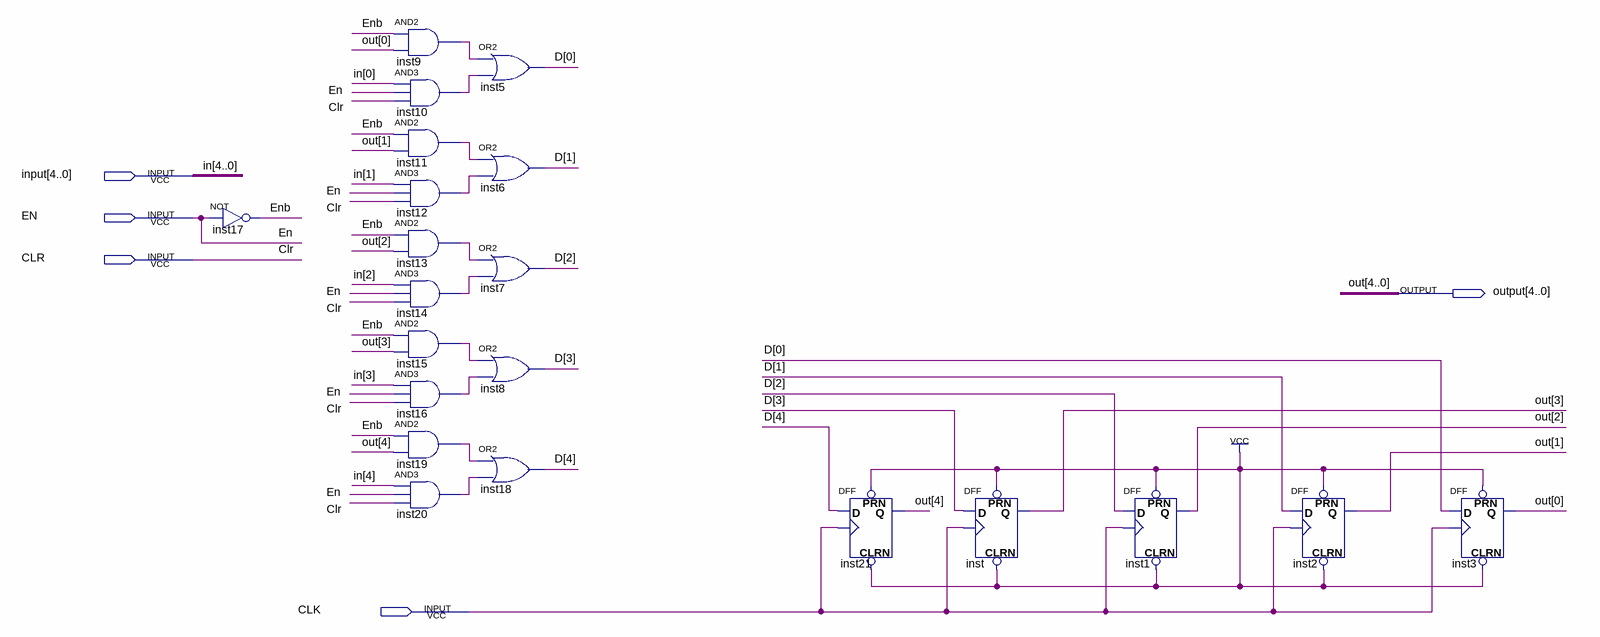
[diagram p0: schematic sheet]
// Quartus schematic Registrador5bits.bdf as structural Verilog: 21 symbols, 5 pins
module Registrador5bits (
  input  [4:0] \input ,
  input  EN,
  input  CLR,
  input  CLK,
  output [4:0] \output 
);

  wire Enb, inst9_out, inst10_out, inst11_out, inst12_out, inst13_out, inst14_out, inst15_out, inst16_out,
       inst19_out, inst20_out;
  wire [4:0] D;

  not inst17 (Enb, EN);
  and inst9 (inst9_out, Enb, \output [0]);
  and inst10 (inst10_out, \input [0], EN, CLR);
  and inst11 (inst11_out, Enb, \output [1]);
  and inst12 (inst12_out, \input [1], EN, CLR);
  and inst13 (inst13_out, Enb, \output [2]);
  and inst14 (inst14_out, \input [2], EN, CLR);
  and inst15 (inst15_out, Enb, \output [3]);
  and inst16 (inst16_out, \input [3], EN, CLR);
  and inst19 (inst19_out, Enb, \output [4]);
  and inst20 (inst20_out, \input [4], EN, CLR);
  or inst5 (D[0], inst9_out, inst10_out);
  or inst6 (D[1], inst11_out, inst12_out);
  or inst7 (D[2], inst13_out, inst14_out);
  or inst8 (D[3], inst15_out, inst16_out);
  or inst18 (D[4], inst19_out, inst20_out);
  DFF inst21 (.CLRN(1'b1), .CLK(CLK), .D(D[4]), .PRN(1'b1), .Q(\output [4]));
  DFF inst (.CLRN(1'b1), .CLK(CLK), .D(D[3]), .PRN(1'b1), .Q(\output [3]));
  DFF inst1 (.CLRN(1'b1), .CLK(CLK), .D(D[2]), .PRN(1'b1), .Q(\output [2]));
  DFF inst2 (.CLRN(1'b1), .CLK(CLK), .D(D[1]), .PRN(1'b1), .Q(\output [1]));
  DFF inst3 (.CLRN(1'b1), .CLK(CLK), .D(D[0]), .PRN(1'b1), .Q(\output [0]));

  // Other names for the same wires on the sheet: in[4:0] = \input ; out[4:0] = \output 
endmodule
